# EasyEDA schematic TelescopeGoTo MKII.json
TITLE: RedinScopeGoToSchematic; REV: 1.0; Date: 2019-08-30; Sheet: 1/1; Drawn By: ricardo.redin; Company: Redin
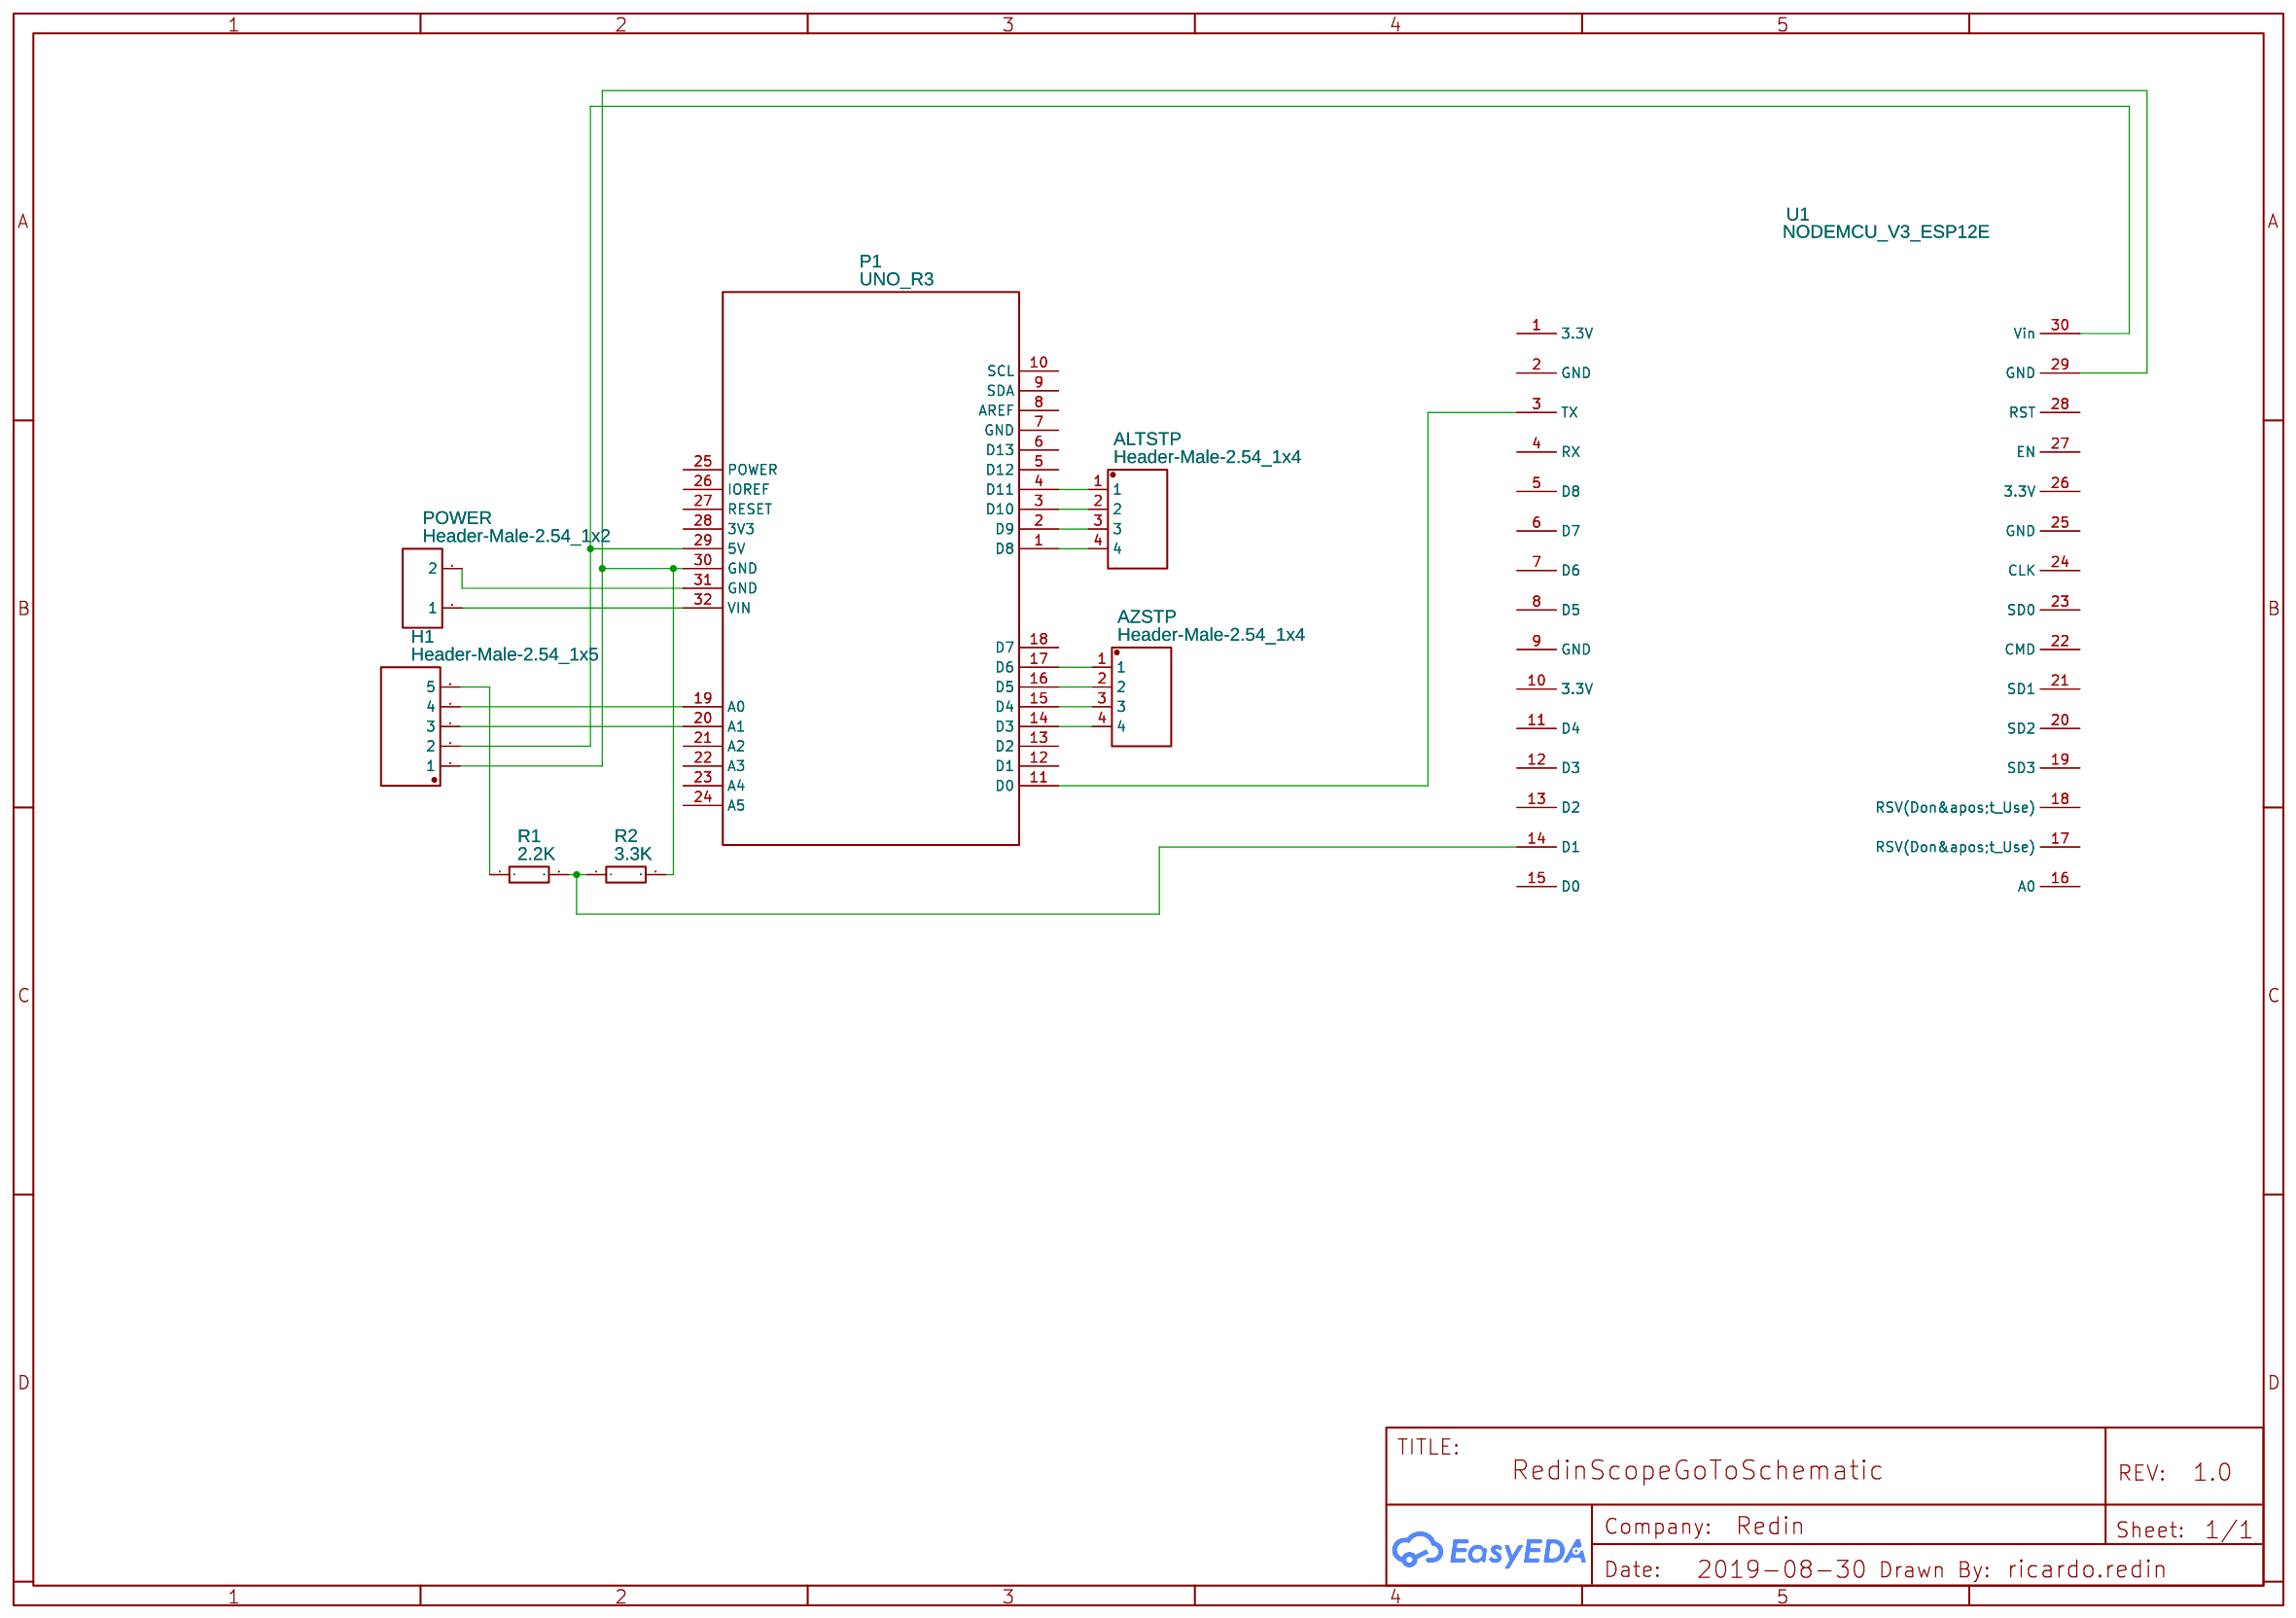
[diagram p0: schematic sheet]

## Parts
ALTSTP  Header-Male-2.54_1x4  [DIP-1X4P-2.54MM-M]
AZSTP  Header-Male-2.54_1x4  [DIP-1X4P-2.54MM-M]
H1  Header-Male-2.54_1x5  [DIP-1X5P-2.54MM-M]
P1  UNO_R3  [UNO_R3]
POWER  Header-Male-2.54_1x2  [HDR-2X1/2.54]
R1  2.2K  [0805]
R2  3.3K  [0805]
U1  NODEMCU_V3_ESP12E  [NODEMCU_V3_ESP12E_FOOTPRINT]

## Library data of the parts
ALTSTP AZSTP = -: Supplier: LCSC; Manufacturer: Ckmtw; Manufacturer Part: 210S-1*4P L=11.6MMGold-plated black; Contributor: LCSC; Supplier Part: C124378
H1 = -: Supplier: LCSC; Manufacturer: Ckmtw; Manufacturer Part: 210S-1*5P L=11.6MMGold-plated black; Contributor: LCSC; Supplier Part: C124379
P1 = -: sourceId: 1T5FDZYC8
POWER = -: Supplier: LCSC; Manufacturer: TE Connectivity; Manufacturer Part: 826629-2; image: //image.lceda.cn/szlcsc/C86471.jpg; Supplier Part: C86471
R1 = 0805W8F2201T5E: Supplier: LCSC; Manufacturer: UniOhm; LCSC Assembly: Yes; Supplier Part: C17520; SMT Type: Basic
R2 = 0805W8F3301T5E: Supplier: LCSC; Manufacturer: UniOhm; LCSC Assembly: Yes; Supplier Part: C26010; SMT Type: Basic
U1 = NODEMCU_V3_ESP12E: Contributor: mintsrcuthm; sourceId: OGtr1ZXUS; Manufacturer Part: NODEMCU; Supplier Part: ESP12E

## Nets
Net-(ALTSTP-1): ALTSTP.1 P1.4(D11)
Net-(ALTSTP-2): ALTSTP.2 P1.3(D10)
Net-(ALTSTP-3): ALTSTP.3 P1.2(D9)
Net-(ALTSTP-4): ALTSTP.4 P1.1(D8)
Net-(AZSTP-1): AZSTP.1 P1.17(D6)
Net-(AZSTP-2): AZSTP.2 P1.16(D5)
Net-(AZSTP-3): AZSTP.3 P1.15(D4)
Net-(AZSTP-4): AZSTP.4 P1.14(D3)
Net-(H1-1): H1.1 P1.30(GND) R2.2 U1.29(GND)
Net-(H1-2): H1.2 P1.29(5V) U1.30(Vin)
Net-(H1-3): H1.3 P1.20(A1)
Net-(H1-4): H1.4 P1.19(A0)
Net-(H1-5): H1.5 R1.1
Net-(P1-11): P1.11(D0) U1.3(TX)
Net-(P1-31): P1.31(GND) POWER.2
Net-(P1-32): P1.32(VIN) POWER.1
Net-(R1-2): R1.2 R2.1 U1.14(D1)

Not connected (* = marked no-connect by the designer): P1 5(D12) 6(D13) 7(GND) 8(AREF) 9(SDA) 10(SCL) 12(D1) 13(D2) 18(D7) 21(A2) 22(A3) 23(A4) 24(A5) 25(POWER) 26(IOREF) 27(RESET) 28(3V3); U1 1(3.3V) 2(GND) 4(RX) 5(D8) 6(D7) 7(D6) 8(D5) 9(GND) 10(3.3V) 11(D4) 12(D3) 13(D2) 15(D0) 16(A0) 17(RSV(Don't Use)) 18(RSV(Don't Use)) 19(SD3) 20(SD2) 21(SD1) 22(CMD) 23(SD0) 24(CLK) 25(GND) 26(3.3V) 27(EN) 28(RST)
